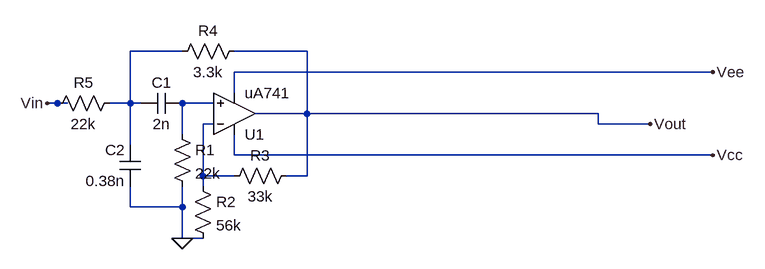
[diagram p0: schematic BandPass.asc]
BandPass.asc, the LTspice schematic file:
Version 4
SHEET 1 880 680
WIRE 0 48 -80 48
WIRE 192 48 80 48
WIRE 816 80 80 80
WIRE 80 112 80 80
WIRE -192 128 -208 128
WIRE -176 128 -192 128
WIRE -80 128 -80 48
WIRE -80 128 -112 128
WIRE -64 128 -80 128
WIRE 48 128 0 128
WIRE 192 144 192 48
WIRE 192 144 112 144
WIRE 640 144 192 144
WIRE 48 160 32 160
WIRE 640 160 640 144
WIRE 720 160 640 160
WIRE 0 176 0 128
WIRE -80 192 -80 128
WIRE 80 208 80 176
WIRE 816 208 80 208
WIRE 32 240 32 160
WIRE 80 240 32 240
WIRE 192 240 192 144
WIRE 192 240 160 240
WIRE 32 256 32 240
WIRE -80 288 -80 256
WIRE 0 288 0 256
WIRE 0 288 -80 288
WIRE 0 336 0 288
WIRE 32 336 0 336
FLAG 0 336 0
FLAG -208 128 Vin
FLAG 720 160 Vout
FLAG 816 208 Vcc
FLAG 816 80 Vee
SYMBOL Opamps\\uA741 80 208 M180
SYMATTR InstName U1
SYMBOL cap 0 112 R90
WINDOW 0 0 32 VBottom 2
WINDOW 3 32 32 VTop 2
SYMATTR InstName C1
SYMATTR Value 2n
SYMBOL cap -64 256 R180
WINDOW 0 24 56 Left 2
WINDOW 3 24 8 Left 2
SYMATTR InstName C2
SYMATTR Value 0.38n
SYMBOL res -16 160 R0
SYMATTR InstName R1
SYMATTR Value 22k
SYMBOL res 16 240 R0
SYMATTR InstName R2
SYMATTR Value 56k
SYMBOL res 176 224 R90
WINDOW 0 0 56 VBottom 2
WINDOW 3 32 56 VTop 2
SYMATTR InstName R3
SYMATTR Value 33k
SYMBOL res 96 32 R90
WINDOW 0 0 56 VBottom 2
WINDOW 3 32 56 VTop 2
SYMATTR InstName R4
SYMATTR Value 3.3k
SYMBOL res -96 112 R90
WINDOW 0 0 56 VBottom 2
WINDOW 3 32 56 VTop 2
SYMATTR InstName R5
SYMATTR Value 22k

The netlist it stands for:
* BandPass.asc
XU1 N002 N003 Vcc Vee Vout uA741  ; pins In+ In- V+ V- OUT
C1 N002 N001 2n
C2 0 N001 0.38n
R1 N002 0 22k
R2 N003 0 56k
R3 Vout N003 33k
R4 Vout N001 3.3k
R5 N001 Vin 22k
.backanno
.end